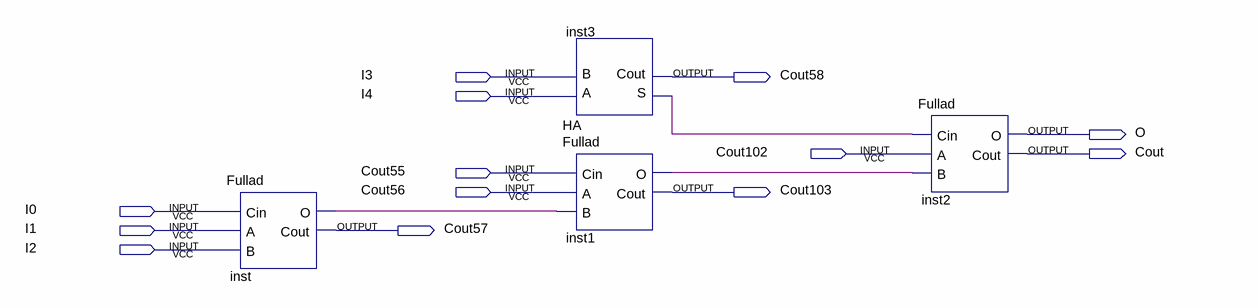
[diagram p0: schematic sheet]
// Quartus schematic B9.bdf as structural Verilog: 4 symbols, 13 pins
module B9 (
  input  I3,
  input  I4,
  input  Cout102,
  input  Cout55,
  input  Cout56,
  input  I0,
  input  I1,
  input  I2,
  output Cout58,
  output O,
  output Cout,
  output Cout103,
  output Cout57
);

  wire inst1_o, inst3_s, inst_o;

  Fullad inst (.Cin(I0), .A(I1), .B(I2), .O(inst_o), .Cout(Cout57));
  HA inst3 (.A(I4), .B(I3), .S(inst3_s), .Cout(Cout58));
  Fullad inst1 (.Cin(Cout55), .A(Cout56), .B(inst_o), .O(inst1_o), .Cout(Cout103));
  Fullad inst2 (.Cin(inst3_s), .A(Cout102), .B(inst1_o), .O(O), .Cout(Cout));
endmodule
